# Altium schematic sheet Nav_Buttons.SchDoc: Nav Buttons
size 431 x 279 mm; VersionControl_RevNumber: 1.0; VersionControl_ProjFolderRevNumber: 1.0.0; ApprovedBy: ESE; CheckedBy: Justin, Bhagath; Author: Justin, bhagath; CompanyName: ESE Dept; DrawnBy: Justin, Bhagath; Engineer: Justin, Bhagath; Organization: ORGANIZATION; Address1: Electrical Engineering; Address2: 200 S 33rd St; Address3: Philadelphia; Address4: Pa 19104; DocumentNumber: 7; Revision: -; SheetNumber: 7; SheetTotal: 7; Project: ProtoWatch; ENG_APP_DATE: 02/12/21; DSN_APP_DATE: 02/12/21; CHK_APP_DATE: 02/12/21
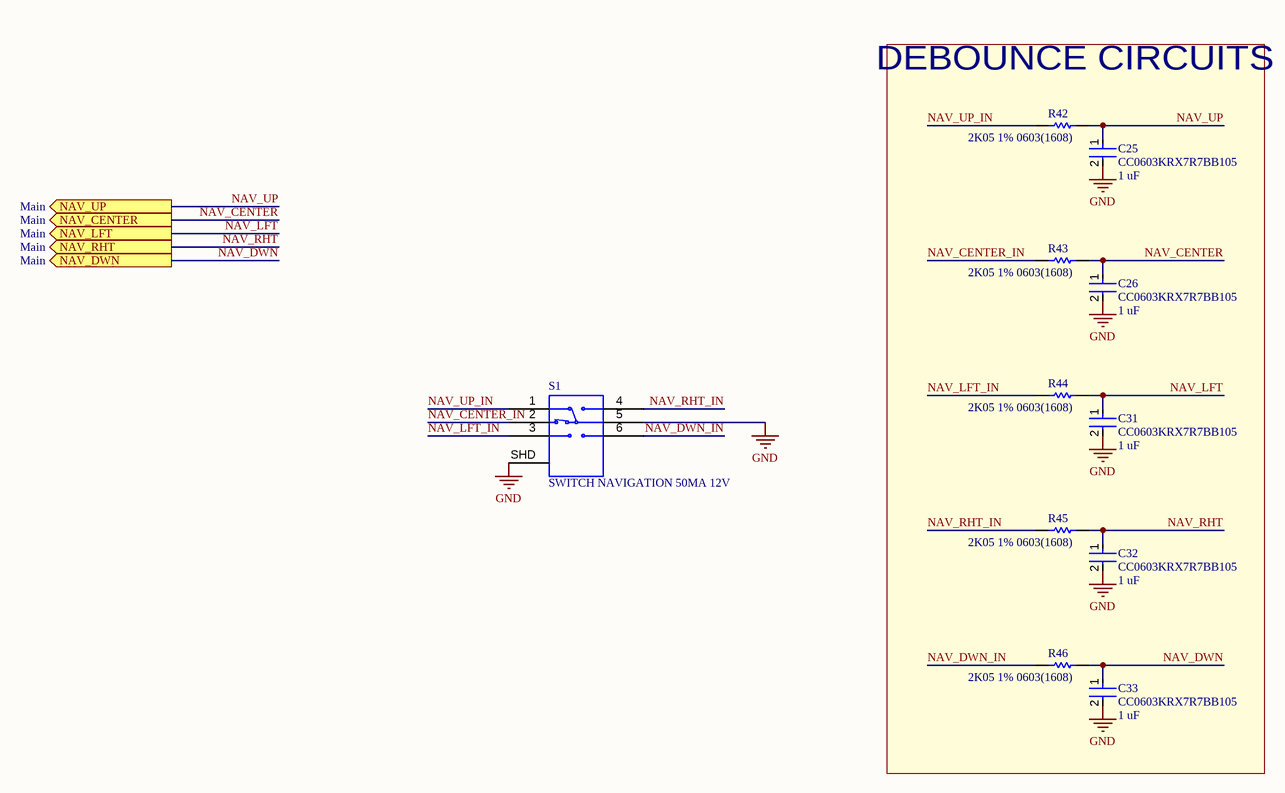
[diagram p0: Nav_Buttons.SchDoc]

## Parts
C25  CC0603KRX7R7BB105  value 1 uF  [FP-CC0603-DA-MFG]
C26  CC0603KRX7R7BB105  value 1 uF  [FP-CC0603-DA-MFG]
C31  CC0603KRX7R7BB105  value 1 uF  [FP-CC0603-DA-MFG]
C32  CC0603KRX7R7BB105  value 1 uF  [FP-CC0603-DA-MFG]
C33  CC0603KRX7R7BB105  value 1 uF  [FP-CC0603-DA-MFG]
R42  2K05 1% 0603(1608)  [RESC0603(1608)_L]
R43  2K05 1% 0603(1608)  [RESC0603(1608)_L]
R44  2K05 1% 0603(1608)  [RESC0603(1608)_L]
R45  2K05 1% 0603(1608)  [RESC0603(1608)_L]
R46  2K05 1% 0603(1608)  [RESC0603(1608)_L]
S1  SWITCH NAVIGATION 50MA 12V  [SW_JS1400AFQ]

## Blocks framed on the sheet
DEBOUNCE CIRCUITS: C25 C26 C31-C33 R42-R46

## Ports
NAV_CENTER (out, see Main), NAV_DWN (out, see Main), NAV_LFT (out, see Main), NAV_RHT (out, see Main), NAV_UP (out, see Main)

## Nets
GND: C25.2 C26.2 C31.2 C32.2 C33.2 S1.5 S1.SHD(SHIELD)
NAV_CENTER: C26.1 R43.2 ; port NAV_CENTER
NAV_CENTER_IN: R43.1 S1.2
NAV_DWN: C33.1 R46.2 ; port NAV_DWN
NAV_DWN_IN: R46.1 S1.6
NAV_LFT: C31.1 R44.2 ; port NAV_LFT
NAV_LFT_IN: R44.1 S1.3
NAV_RHT: C32.1 R45.2 ; port NAV_RHT
NAV_RHT_IN: R45.1 S1.4
NAV_UP: C25.1 R42.2 ; port NAV_UP
NAV_UP_IN: R42.1 S1.1

## Notes on the sheet
- DWG. NO.
- REV.
- SHT.
- THIS DOCUMENT AND THE DATA DISCLOSED HEREIN OR HEREWITH IS THE PROPERTY OF ALTIUM LIMITED AND MAY BE FREELY DISTRIBUTED IN WHOLE. NO RIGHTS ARE RESERVED OR EXPRESS OR IMPLIED WARANTEE GIVEN.
- REVISION
- DESCRIPTION
- DATE
- APPROVED
- ENG:
- APPROVALS
- PROJECT
- DSN:
- CHK:
- REFERENCE DOCUMENTS
- PROJECT REVISION:
- TITLE
- DOCUMENT REVISION:
- DESIGN ITEM:
- BOM:
- FAB DWG:
- PCB DWG:
- ASSY DWG:
- SCALE:
- SIZE
- B
- CAGE CODE
- FILE NAME
- DWG NO.
- SHEET
- OF
- REV

## Library data of the parts
C25 C26 C31-C33 = CMP-03422-000924-1: CAP CER 1UF 16V X7R 0603; Manufacturer: YAGEO; Tolerance: 0.1; Temperature Coefficient: 15%; Material: Ceramic; Package: CC0603-DA; RoHS: TRUE; Device Class L2: Capacitors; Temperature Characteristic: X7R; Temperature: -55°C to +125°C; Temperature Range Low: -55°C; Automotive: No; ComponentLink2Description: Datasheet; Lead Free: Yes; Capacitance: 1 uF; ComponentLink2URL: http://www.yageo.com/documents/recent/UPY-GPHC_X7R_6.3V-to-50V_18.pdf; Device Class L1: Passive Components; Voltage: 16 V; Octopart: https://octopart.com/cc0603krx7r7bb105-yageo-42271928; Category: Cap; Digikey Description: CAP CER 1UF 16V X7R 0603; Footprint Url: http://www.yageo.com/exep/pages/download/literatures/UPY-C_GEN_24.pdf; Height: 0.9mm; Manufacturer Part Number: CC0603KRX7R7BB105; Voltage Rating: 16 V; Temperature Range High: +125°C; Mouser Description: Multilayer Ceramic Capacitor, CC Series, 1 - F, - 10%, X7R, 16 V, 0603 [1608 Metric]; Device Class L3: Ceramic Capacitors
R42-R46 = CMP-1012-00543-1: 2K05 0.1W 1% 0603 (1608 Metric)  SMD; Value: 2050.00 Ohm; Case-Metric: 1608; Case-EIA: 0603; Tolerance: 1 %; Technology: SMT; Power: 0.1 W
S1 = JS1400AFQ: Navigation Switch, 2 - Axis Digital (Mechanical Switch) Output; MF: E-Switch; Digi-Key_Part_Number: EG5857-ND; MP: JS1400AFQ; Value: *; Package: None; manufacturer Part Number 1: JS1400AFQ